# Altium schematic sheet AMS1117-3.3V.SchDoc
size A; SheetNumber: 11; SheetTotal: 12
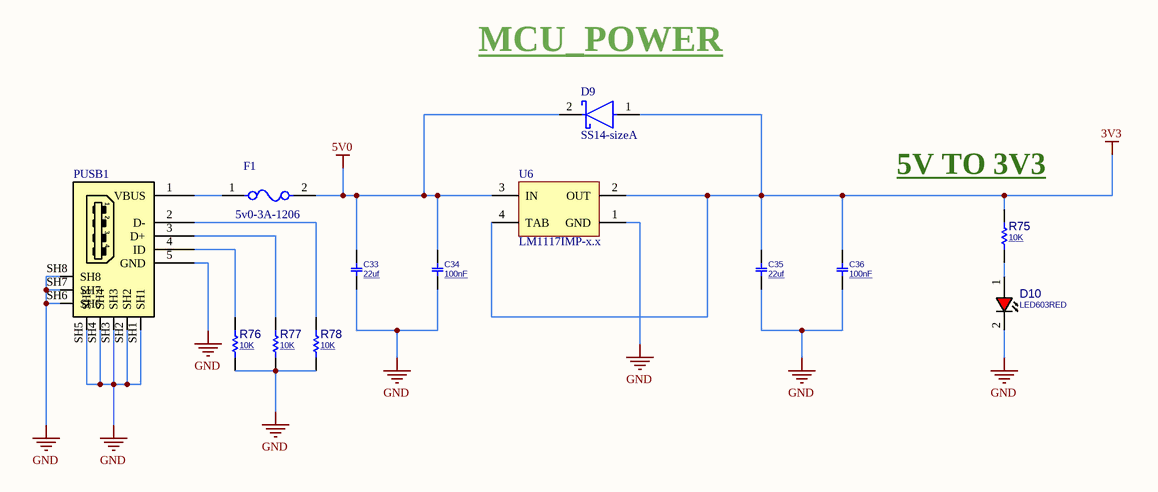
[diagram p0: AMS1117-3.3V.SchDoc]

## Parts
C33  22uf  [C1206]
C34  100nF  [C0603]
C35  22uf  [C1206]
C36  100nF  [C0603]
D9  SS14-sizeA  [FP-403AE-MFG]
D10  LED603RED  [LED0603RED]
F1  5v0-3A-1206  [FP-nanoSMDC-MFG]
PUSB1  CONN_USB_MICROB  [USB_MICRO_B_BM_SHS]  (value not drawn)
R75  10K  [R0603]
R76  10K  [R0603]
R77  10K  [R0603]
R78  10K  [R0603]
U6  LM1117IMP-x.x  [SOT223]

## Nets
3V3: C35.2 C36.2 D9.1(A) R75.1 U6.2(OUT) U6.4(TAB)
5V0: C33.2 C34.2 D9.2(C) F1.2 U6.3(IN)
GND: C33.1 C34.1 C35.1 C36.1 D10.2(CATHODE) PUSB1.5(GND) PUSB1.SH1 PUSB1.SH2 PUSB1.SH3 PUSB1.SH4 PUSB1.SH5 PUSB1.SH6 PUSB1.SH7 PUSB1.SH8 R76.2 R77.2 R78.2 U6.1(GND)
NetD10_1: D10.1(ANODE) R75.2
NetF1_1: F1.1 PUSB1.1(VBUS)
NetPUSB1_2: PUSB1.2(D-) R78.1
NetPUSB1_3: PUSB1.3(D+) R77.1
NetPUSB1_4: PUSB1.4(ID) R76.1

## Notes on the sheet
- MCU_POWER
- (near R75) 5V TO 3V3

## Library data of the parts
C33 C35 = CAP_SMD_MLCC_1206: CAP, MLCC, -F, -V, MATERIAL, -%, 0201; PARAM: -, -%; MANF_P#: MANF_PART#; PRICE: 100= 1$; MANF: -; PARAM2: -V; ASSEMBLY: ASSEMBLY; VALUE: 22uf
C34 C36 = CAP_SMD_MLCC_0603: CAP, MLCC, -F, -V, MATERIAL, -%, 0201; PARAM: -, -%; MANF_P#: MANF_PART#; PRICE: 100= 1$; MANF: -; PARAM2: -V; ASSEMBLY: ASSEMBLY; VALUE: 100nF
D9 = ss14: DIODE SCHOTTKY 40V 1A SMA; Manufacturer: ON Semiconductor; Peak Reverse Current: 0.2mA; Max Junction Temp: +125°C; Standoff Height: 0.05mm; Max Surge Forward Current: 40A; Mouser Description: Schottky Diodes & Rectifiers SMA 40V 1.0A; RoHS: TRUE; Lead Free: Yes; Manufacturer Part Number: SS14; Device Class L3: Schottky Diodes; Category: Diode; Automotive: No; Digikey Description: DIODE SCHOTTKY 40V 1A SMA; ComponentLink2Description: Datasheet; Device Class L2: Diodes; Height: 2.5mm; Temperature Range High: +125°C; ComponentLink2URL: https://www.onsemi.com/pub/Collateral/SS19-D.PDF; Device Class L1: Discrete Semiconductors; Package: 403AE; Octopart: https://octopart.com/ss14-on+semiconductor-29205033; Max Repetitive Reverse Voltage: 40V; Temperature Range Low: -65°C; Forward Current: 1A; Temperature: -65°C to +125°C
D10 = LED_SMD_0603_RED: LED, SMD, 0603, RED; PARAM: 30mA, 640nm; DESC: DESCRIPTION; MANF_P#: MANF_PART#; PARAM2: 1.8~2.5V; MANF: MANF; ASSEMBLY: ASSEMBLY; PRICE: PRICE; VALUE: LED603RED
F1 = CMP-08606-000049-1: PTC RESET FUSE 48V 120MA 1206; Manufacturer: Littelfuse; Manufacturer Part Number: NANOSMDC012F-2; Trip Current: 0.39A; Resistance: 1.4-6.5Ω; Value: 1.4-6.5Ω; Current Rating: 10A; Hold Current: 0.12A; Trip Time: 0.2s; Category: Fuse; Device Class L2: PTC Resettable Fuses; ComponentLink2Description: Datasheet; Automotive: No; Package: nanoSMDC; Ambient Temperature Range Low: -40°C; Lead Free: Yes; Voltage Rating: 48V; Mouser Description: PTC Resettable Fuse 0.12A(hold) 0.39A(trip) 48VDC 10A 0.5W 0.2s 1.4Ohm SMD Solder Pad 1206 T/R Automotive; Octopart: https://octopart.com/nanosmdc012f-2-littelfuse-74215047; Device Class L1: Circuit Protection; Temperature Range High: +85°C; ComponentLink2URL: https://www.littelfuse.com/~/media/electronics/datasheets/resettable_ptcs/littelfuse_ptc_nanosmdc_datasheet.pdf.pdf; Temperature: to +85°C; Height: 1mm; Ambient Temperature Range High: +85°C; Digikey Description: PTC RESET FUSE 48V 120MA 1206; Device Class L3: unset; RoHS: TRUE
PUSB1 = CONN_USB_MICRO_B_BM_SHS: CONN, USB, MICRO B, R/A, SMD, BOTTOM MOUNT; MANF_P#: 47346-0001; MANF: Molex; MANF_P#2: HIROSE ZX62-AB-5PA; PARAM2: 30VAC; PARAM: 1.8A, -20~85oC; PRICE: 0.75$; VALUE: CONN_USB_MICROB
R75-R78 = RES_SMD: RESISTOR, SMD; PARAM: -W; DESC: DESCRIPTION; DIST#: MOUSER; PARAM2: 1%; MANF_P#: -; MANF: -; ASSEMBLY: ASSEMBLY; PRICE: 100= 0.5$; VALUE: 10K
U6 = LM1117IMP-x.x: x.x Volt, 800mA Low-Dropout Linear Regulator, 4-pin SOT-223; ComponentLink1Description: Website: Tarahiboard; ComponentLink1URL: https://www.tarahiboard.com/; ComponentLink2Description: Telegram; ComponentLink2URL: https://t.me/tarahiboard; ComponentLink3Description: Instagram; ComponentLink3URL: https://instagram.com/tarahiboard; DatasheetVersion: 2021